# EAGLE design Air Quality (EAGLE 9.6.2)
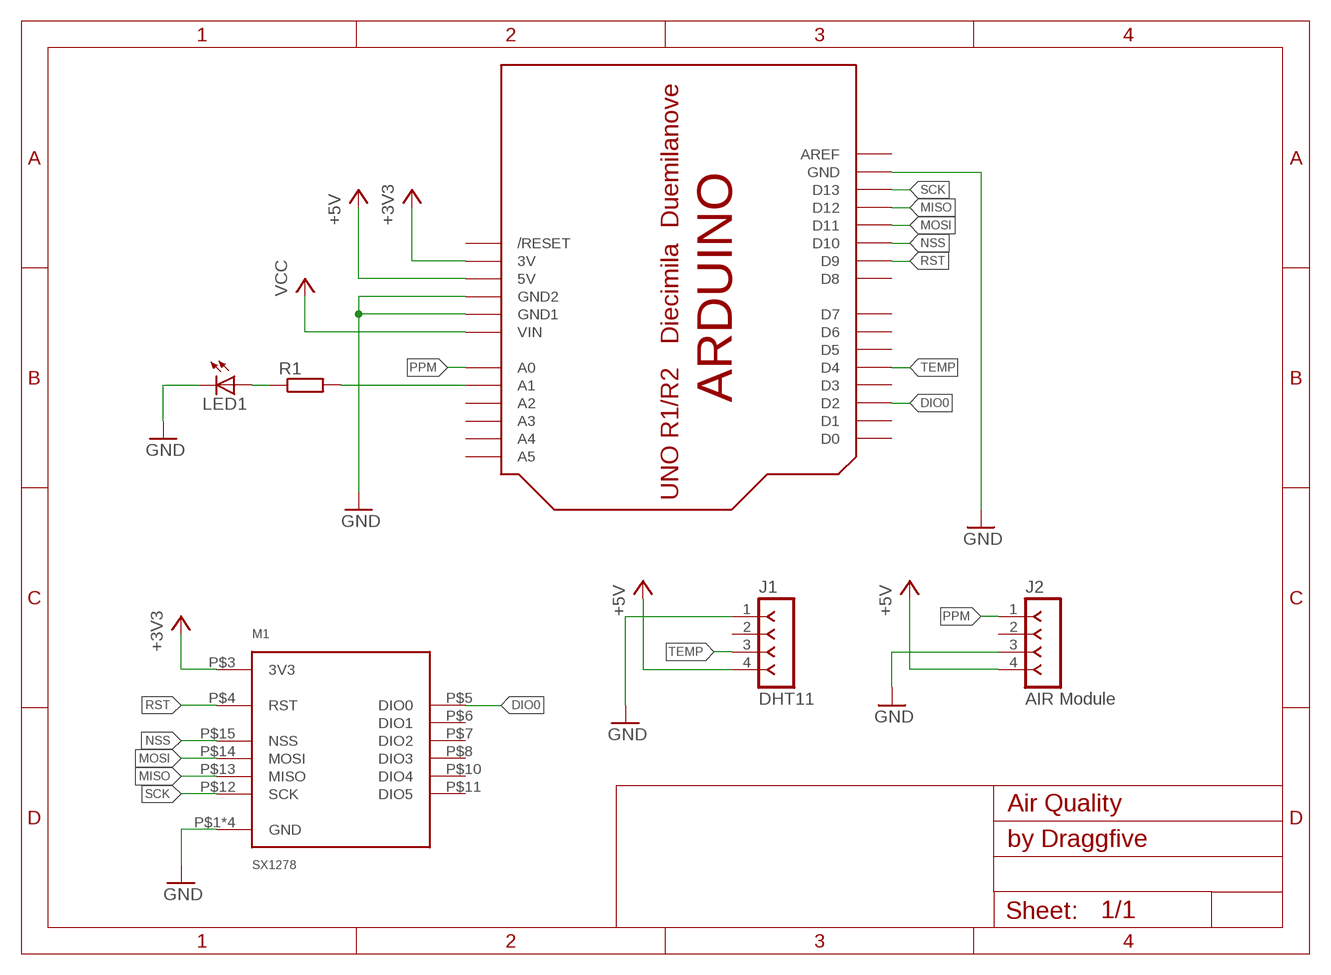
[diagram p0: schematic, sheet 1]

## Parts
J1  DHT11  F-1X04-SIP-100-32Y  [SIP-100-04-32Y]
J2  AIR Module  F-1X04-SIP-100-40Y  [SIP-100-04-40Y]
LED1  LED5MM  [LED5MM]
M1  SX1278  [SX1278]
R1  R-EU_0207/10  [0207/10]
U$1  ARDUINOUNO  [ARDUINO]

## Nets
+3V3: M1.P$3(3V3) U$1.3V
+5V: J1.4 J2.4 U$1.5V
DIO0: M1.P$5(DIO0) U$1.D2
GND: J1.1 J2.3 LED1.K(C) M1.P$1(GND) M1.P$2(GND) M1.P$9(GND) M1.P$16(GND) U$1.GND U$1.GND1 U$1.GND2
MISO: M1.P$13(MISO) U$1.D12
MOSI: M1.P$14(MOSI) U$1.D11
N$1: LED1.A R1.1
N$2: R1.2 U$1.A1
NSS: M1.P$15(NSS) U$1.D10
PPM: J2.1 U$1.A0
RST: M1.P$4(RST) U$1.D9
SCK: M1.P$12(SCK) U$1.D13
TEMP: J1.3 U$1.D4
VCC: U$1.VIN
Unconnected: J1.2 J2.2 M1.P$6(DIO1) M1.P$7(DIO2) M1.P$8(DIO3) M1.P$10(DIO4) M1.P$11(DIO5) U$1.A2 U$1.A3 U$1.A4 U$1.A5 U$1.AREF U$1.D0 U$1.D1 U$1.D3 U$1.D5 U$1.D6 U$1.D7 U$1.D8 U$1.RESET(/RESET)

## Notes on the sheet
- by Draggfive

## Library data of the parts
J1 J2 = con-headers-jp:F-1X04-: FEMALE HEADER
LED1 = adafruit:LED: LED OSRAM: - CHIPLED LG R971, LG N971, LY N971, LG Q971, LY Q971, LO R971, LY R971 LH N974, LH R974 LS Q976, LO Q976, LY Q976 LO Q996 - Hyper CHIPLED LW Q18S LB Q993, LB Q99A, LB R99A - SideLED LS A670, LO A670, LY A670, LG A670, LP A670 LB A673, LV A673, LT A673, LW A673 LH A674 LY A675 LS A676, LA A676, LO A676, LY A676, LW A676 LS A679, LY A679, LG A679 - Hyper Micro SIDELED® LS Y876, LA Y876, LO Y876, LY Y876 LT Y87S - SmartLED LW L88C, LW L88S LB L89C, LB L89S, LG L890 LS L89K, LO L89K, LY L89K LS L896, LA L896, LO L896, LY L896 - TOPLED LS T670, LO T670, LY T670, LG T670, LP T670 LSG T670, LSP T670, LSY T670, LOP T670, LYG T670 LG T671, LOG T671, LSG T671 LB T673, LV T673, LT T673, LW T673 LH T674 LS T676, LA T676, LO T676, LY T676, LB T676, LH T676, LSB T676, LW T676 LB T67C, LV T67C, LT T67C, LS T67K, LO T67K, LY T67K, LW E67C LS E67B, LA E67B, LO E67B, LY E67B, LB E67C, LV E67C, LT E67C LW T67C LS T679, LY T679, LG T679 LS T770, LO T770, LY T770, LG T770, LP T770 LB T773, LV T773, LT T773, LW T773 LH T774 LS E675, LA E675, LY E675, LS T675 LS T776, LA T776, LO T776, LY T776, LB T776 LHGB T686 LT T68C, LB T68C - Hyper Mini TOPLED® LB M676 - Mini TOPLED Santana® LG M470 LS M47K, LO M47K, LY M47K Source: http://www.osram.convergy.de/
M1 = Modules:SX1278
R1 = rcl:R-EU_: RESISTOR, European symbol; SPICEPREFIX: R
U$1 = adafruit:ARDUINO: Arduino Diecimila/Duemilanove Make a shield with ease, this package has all the named pins as well as the two mounting drill holes and an outline of the USB and DC power connector. The outline is on the DIMENSION layer, so if your board house uses it they will cut the outline to match. http://www.ladyada.net/library/pcb/eaglelibrary.html

## Board
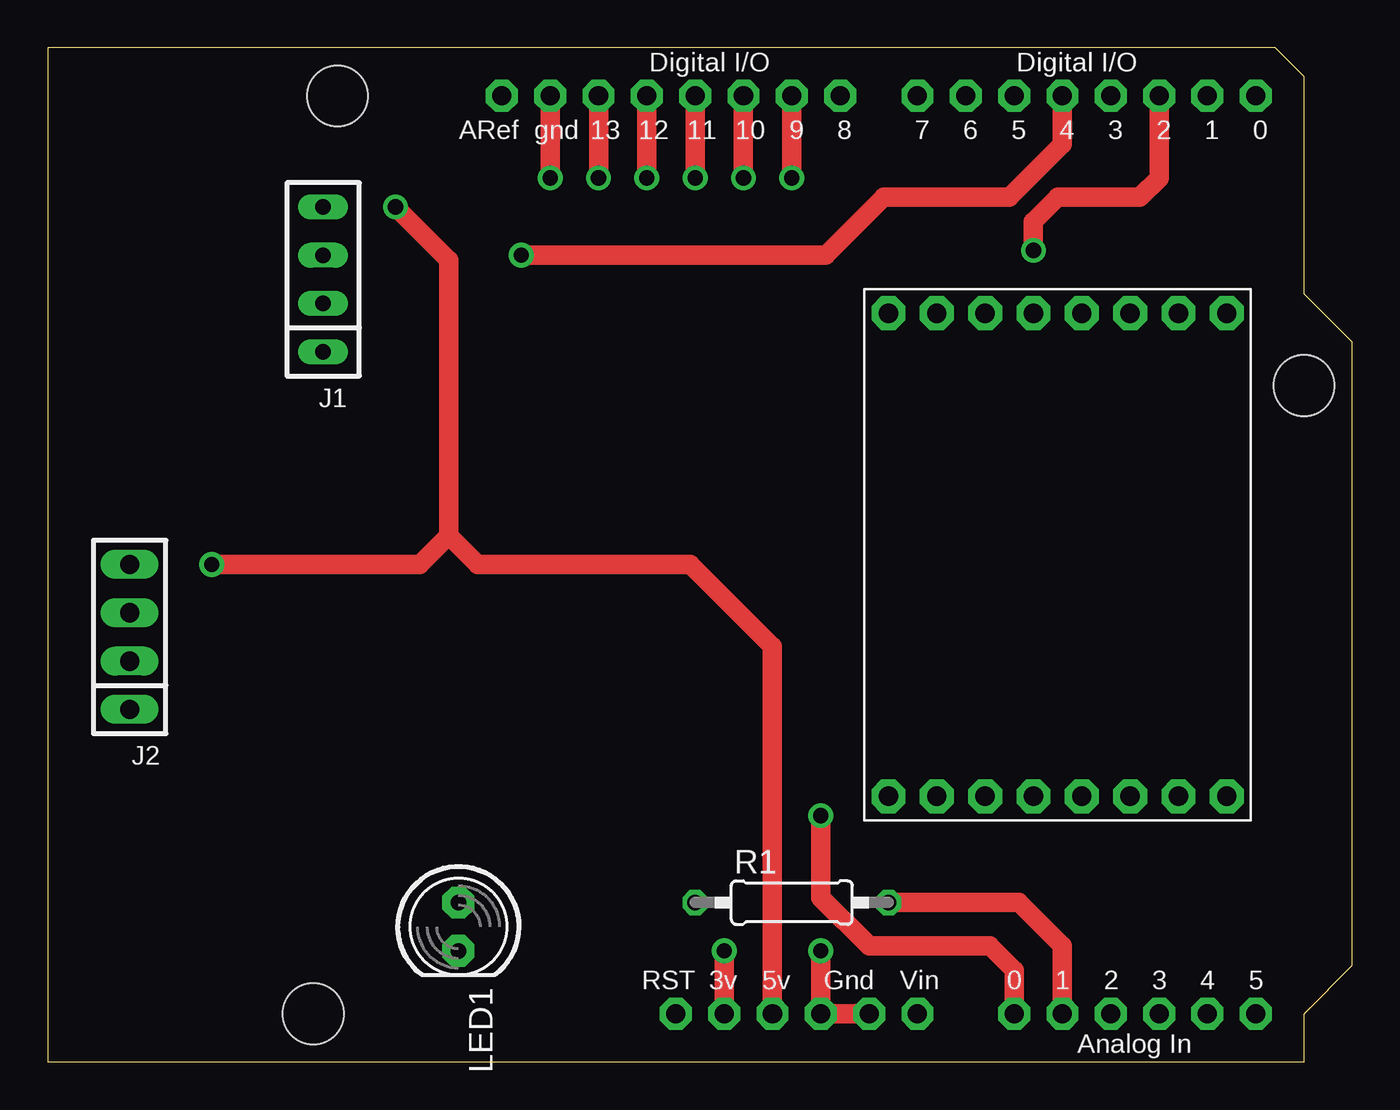
[diagram p1: board, top side]
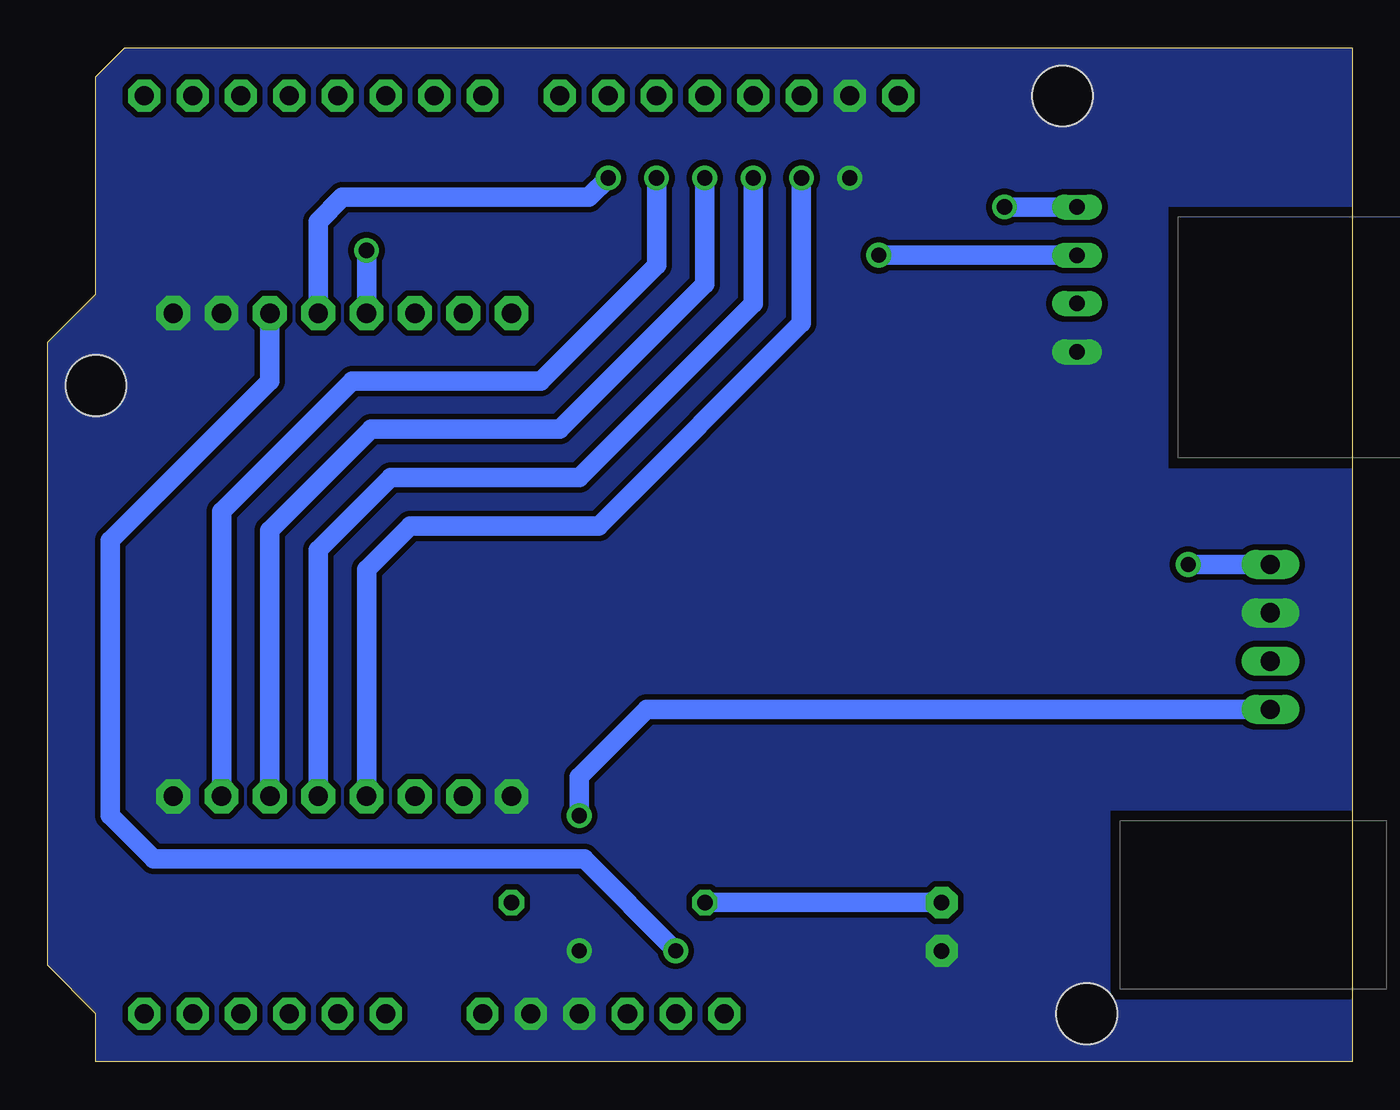
[diagram p2: board, bottom side, seen from below]

Size 68.58 x 53.34 mm. Coordinates in mm from the lower left corner, seen from the top.
Copper layers (1*16): Top 0.035mm / dielectric 1.5mm / Bottom 0.035mm
Design rules "CNC": minimum track width 0.3mm, minimum drill 16mil, track to track 0.3mm, track to pad 0.3mm, pad to pad 0.3mm, via to via 0.3mm, smd to smd 0.3mm, copper to edge 0mil, drill to drill 0.3mm, minimum pad ring 10mil, minimum via ring 10mil, stop-mask expansion 4mil, vias tented up to drill 0mil, thermal gap 0.3mm
bRestrict: area 0,31.2 to 9.7,45; area 0,3.3 to 12.7,13.2

### Footprints (pad centres in the part's own frame; a part is rotated, then mirrored left to right if it is on the bottom)
SIP-100-04-32Y = drill 0.813 long: 1 -3.81,0; 2 -1.27,0; 3 1.27,0; 4 3.81,0
SIP-100-04-40Y = drill 1.016 long: 1 -3.81,0; 2 -1.27,0; 3 1.27,0; 4 3.81,0
LED5MM = drill 0.813 pad 1.676 octagon: A -1.27,0; K 1.27,0
SX1278 = drill 1.016 pad 1.778 octagon: P$1 1.27,19.05; P$2 1.27,16.51; P$3 1.27,13.97; P$4 1.27,11.43; P$5 1.27,8.89; P$6 1.27,6.35; P$7 1.27,3.81; P$8 1.27,1.27; P$9 26.67,1.27; P$10 26.67,3.81; P$11 26.67,6.35; P$12 26.67,8.89; P$13 26.67,11.43; P$14 26.67,13.97; P$15 26.67,16.51; P$16 26.67,19.05
0207/10 = drill 0.813 octagon: 1 -5.08,0; 2 5.08,0
ARDUINO = drill 1 pad 1.676 octagon: 3V 35.56,2.54; 5V 38.1,2.54; A0 50.8,2.54; A1 53.34,2.54; A2 55.88,2.54; A3 58.42,2.54; A4 60.96,2.54; A5 63.5,2.54; AREF 23.876,50.8; D0 63.5,50.8; D1 60.96,50.8; D2 58.42,50.8; D3 55.88,50.8; D4 53.34,50.8; D5 50.8,50.8; D6 48.26,50.8; D7 45.72,50.8; D8 41.656,50.8; D9 39.116,50.8; D10 36.576,50.8; D11 34.036,50.8; D12 31.496,50.8; D13 28.956,50.8; GND 26.416,50.8; GND1 43.18,2.54; GND2 40.64,2.54; RESET 33.02,2.54; VIN 45.72,2.54 | hole 3.2: 15.24,50.8; 66.04,35.56; 13.97,2.54

### Placement (x,y rotation side)
J1  14.48,41.15 90 top
J2  4.32,22.35 90 top
LED1  21.59,7.11 270 top
M1  42.93,40.64 270 top
R1  39.12,8.38 0 top
U$1  0,0 0 top

### Tracks (layer width: path | path; a pad name or v marks a point on that pad's centre or on a via)
+3V3  (via drill 0.8)
  Top 1.016: U$1.3V v35.56,5.84
  Bottom 1.016: v35.56,5.84 40.39,10.67 62.99,10.67 65.28,12.95 65.28,27.43 56.9,35.81 M1.P$3
+5V  (via drill 0.8)
  Top 1.016: U$1.5V 38.1,21.84 33.78,26.16 22.61,26.16 21.08,27.69 | v18.29,44.96 21.08,42.16 21.08,27.69 | 21.08,27.69 19.56,26.16 v8.64,26.16
  Bottom 1.016: J2.4 v8.64,26.16 | J1.4 v18.29,44.96
DIO0  (via drill 0.8)
  Top 1.016: U$1.D2 58.42,46.48 57.4,45.47 53.09,45.47 51.82,44.2 v51.82,42.67
  Bottom 1.016: M1.P$5 v51.82,42.67
GND  (via drill 0.8)
  Top 1.016: U$1.GND1 U$1.GND2 v40.64,5.84 | U$1.GND v26.42,46.48
  pour Bottom (no thermals): 0,53.34 0,0 66.04,0 66.04,2.54 68.58,5.08 68.58,37.85 66.04,40.39 66.04,51.82 64.52,53.34
MISO  (via drill 0.8)
  Top 1.016: v31.5,46.48 U$1.D12
  Bottom 1.016: M1.P$13 54.36,26.92 50.55,30.73 40.64,30.73 31.5,39.88 v31.5,46.48
MOSI  (via drill 0.8)
  Top 1.016: v34.04,46.48 U$1.D11
  Bottom 1.016: M1.P$14 56.9,27.94 51.56,33.27 41.66,33.27 34.04,40.89 v34.04,46.48
N$1
  Bottom 1.016: LED1.A R1.1
N$2
  Top 1.016: U$1.A1 53.34,6.1 51.05,8.38 R1.2
NSS  (via drill 0.8)
  Top 1.016: v36.58,46.48 U$1.D10
  Bottom 1.016: M1.P$15 59.44,28.96 52.58,35.81 42.67,35.81 36.58,41.91 v36.58,46.48
PPM  (via drill 0.8)
  Top 1.016: U$1.A0 50.8,4.83 49.53,6.1 43.18,6.1 40.64,8.64 v40.64,12.95
  Bottom 1.016: v40.64,12.95 40.64,14.99 37.08,18.54 J2.1
RST  (via drill 0.8)
  Top 1.016: v39.12,46.48 U$1.D9
  Bottom 1.016: M1.P$4 54.36,44.2 53.09,45.47 40.13,45.47 v39.12,46.48
SCK  (via drill 0.8)
  Top 1.016: v28.96,46.48 U$1.D13
  Bottom 1.016: M1.P$12 51.82,25.91 49.53,28.19 39.62,28.19 28.96,38.86 v28.96,46.48
TEMP  (via drill 0.8)
  Top 1.016: U$1.D4 53.34,48.26 50.55,45.47 43.94,45.47 40.89,42.42 v24.89,42.42
  Bottom 1.016: v24.89,42.42 J1.3